# Altium schematic sheet PCB_Project_11 Э3 (Контроллер).SchDoc
size 420 x 297 mm; SheetNumber: 2; SheetTotal: 2
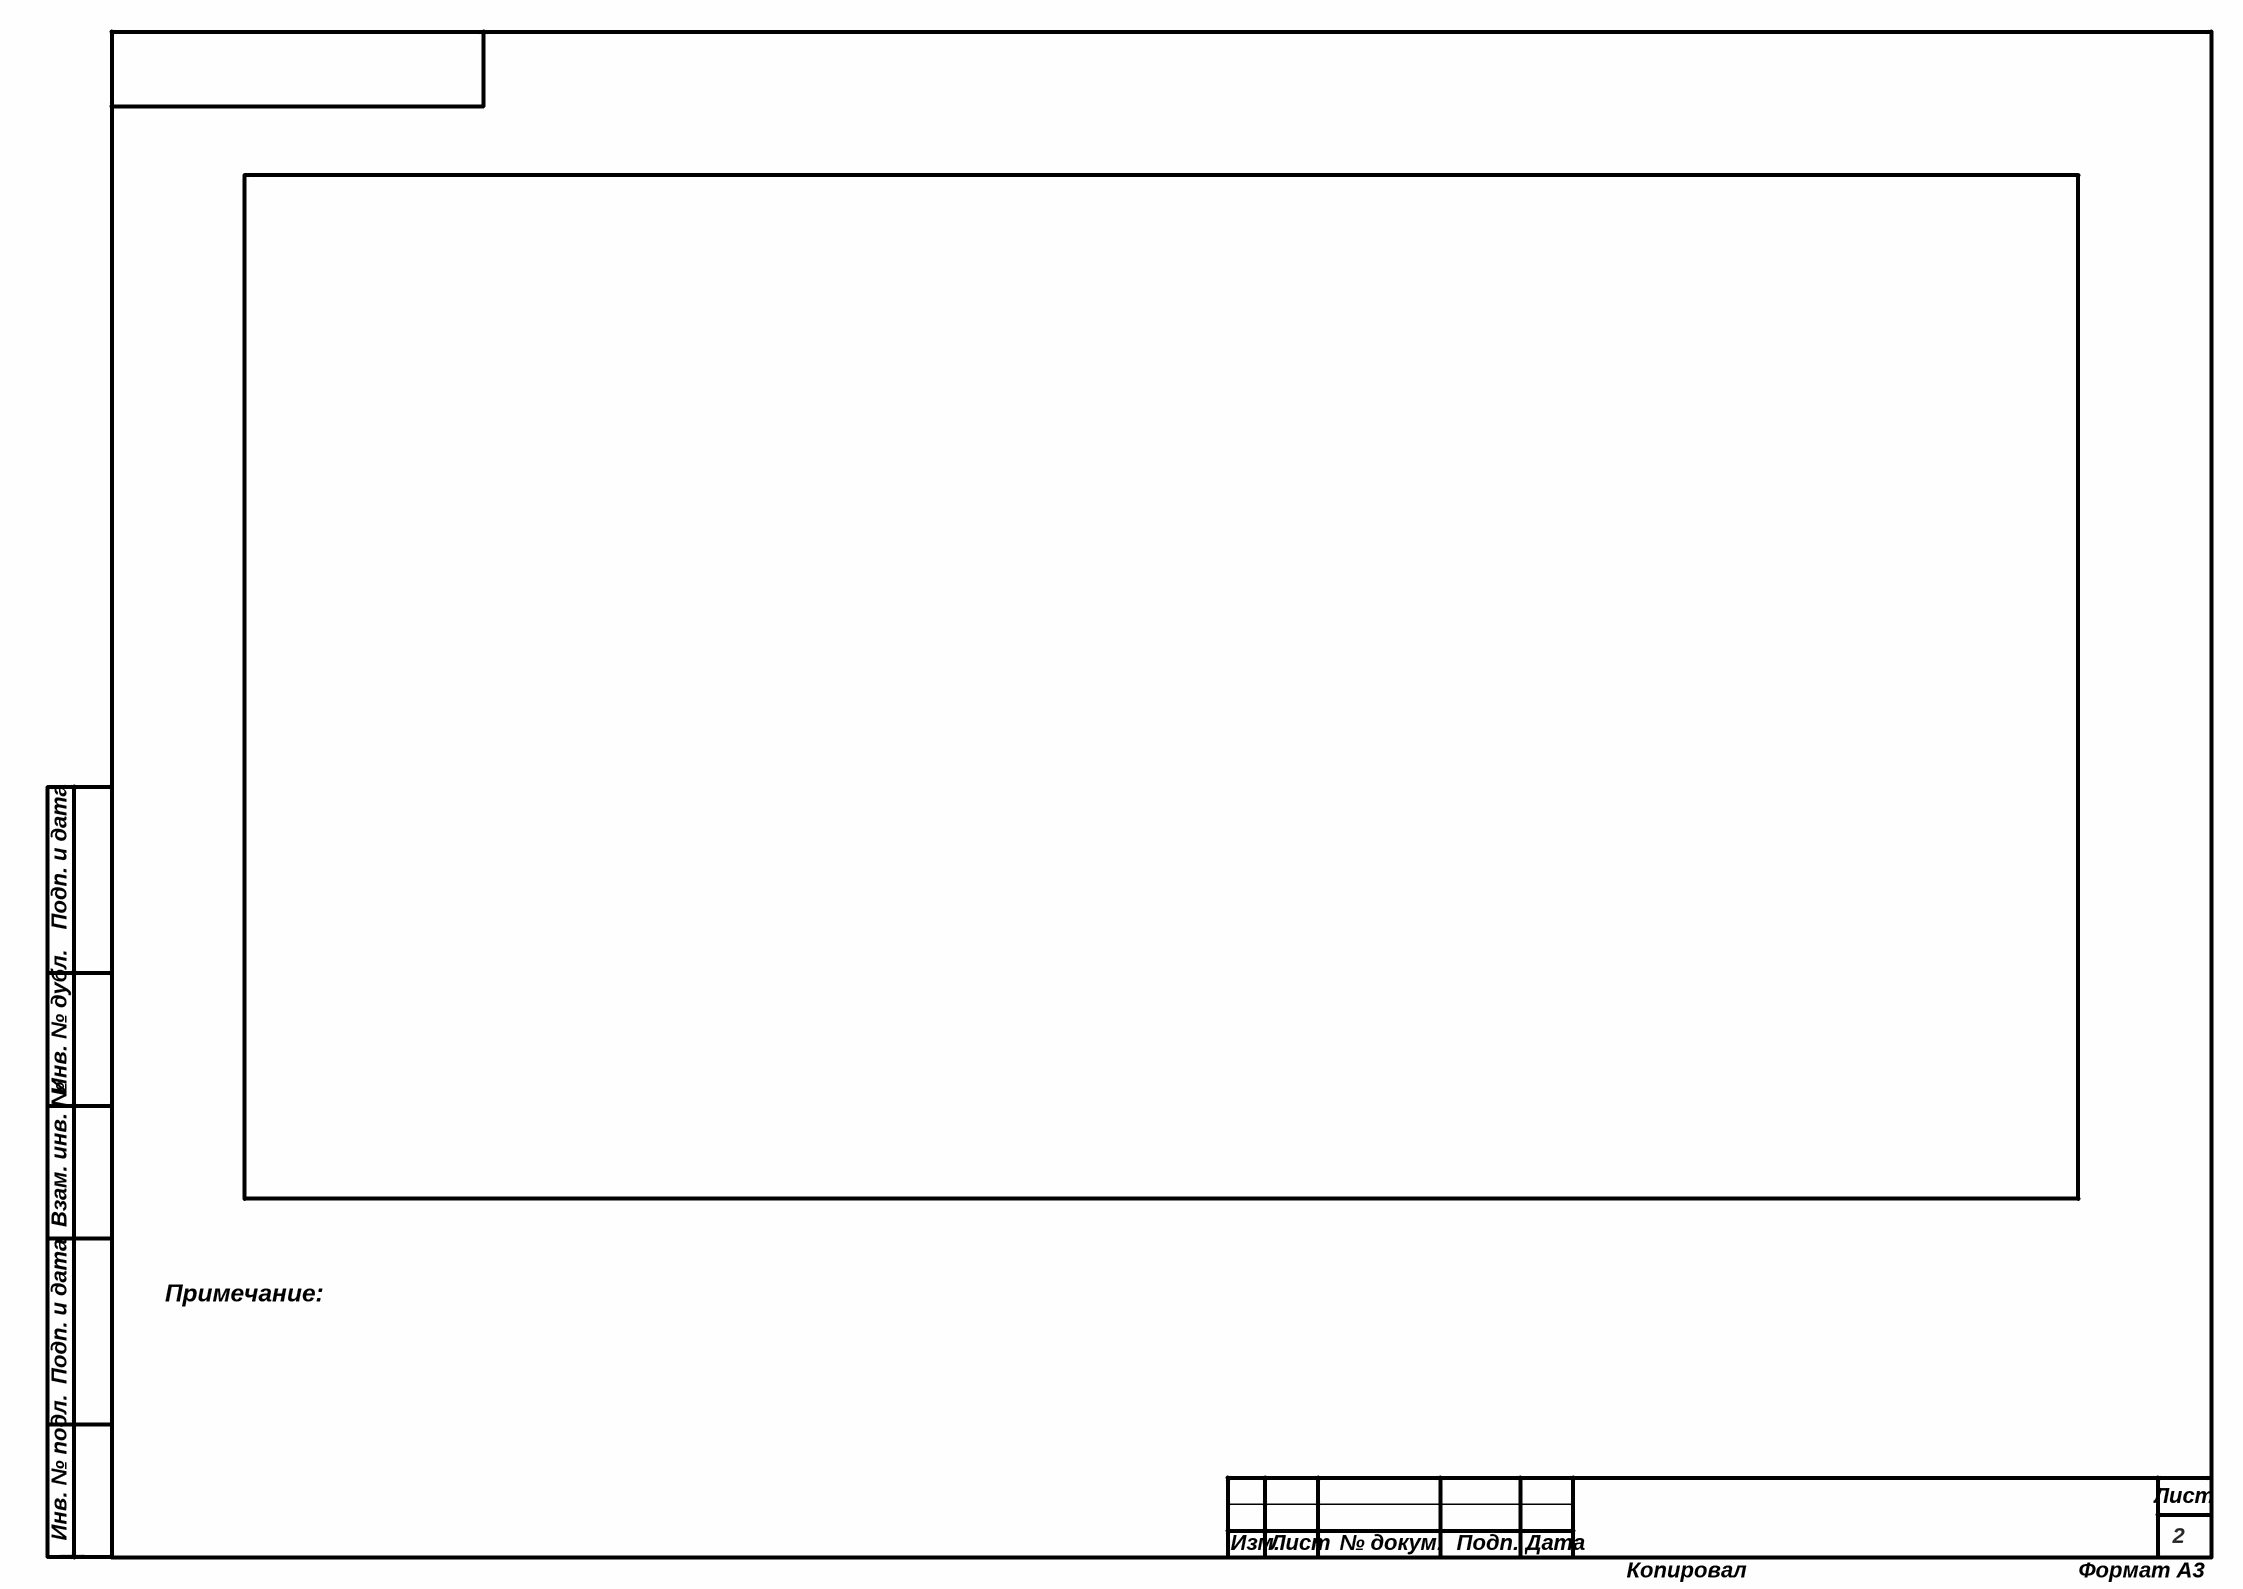
[diagram p0: PCB_Project_11 Э3 (Контроллер).SchDoc]

## Notes on the sheet
- Примечание:
- Подп. и дата
- Инв. № дубл.
- Взам. инв. №
- Инв. № подл.
- Изм.
- Лист
- № докум.
- Подп.
- Дата
- ALTIUM GOSTBOM2.0 KEV
- Копировал
- Формат А3